# EasyEDA Pro project 11111.eprj

# Schematic Schematic1
Create Date: 2024-05-01; Page Name: P1; Project Name: 11111; Schematic Name: Schematic1; Update Date: 2024-05-01; Company: 嘉立创EDA; Page Size: A4; Version: V1.0
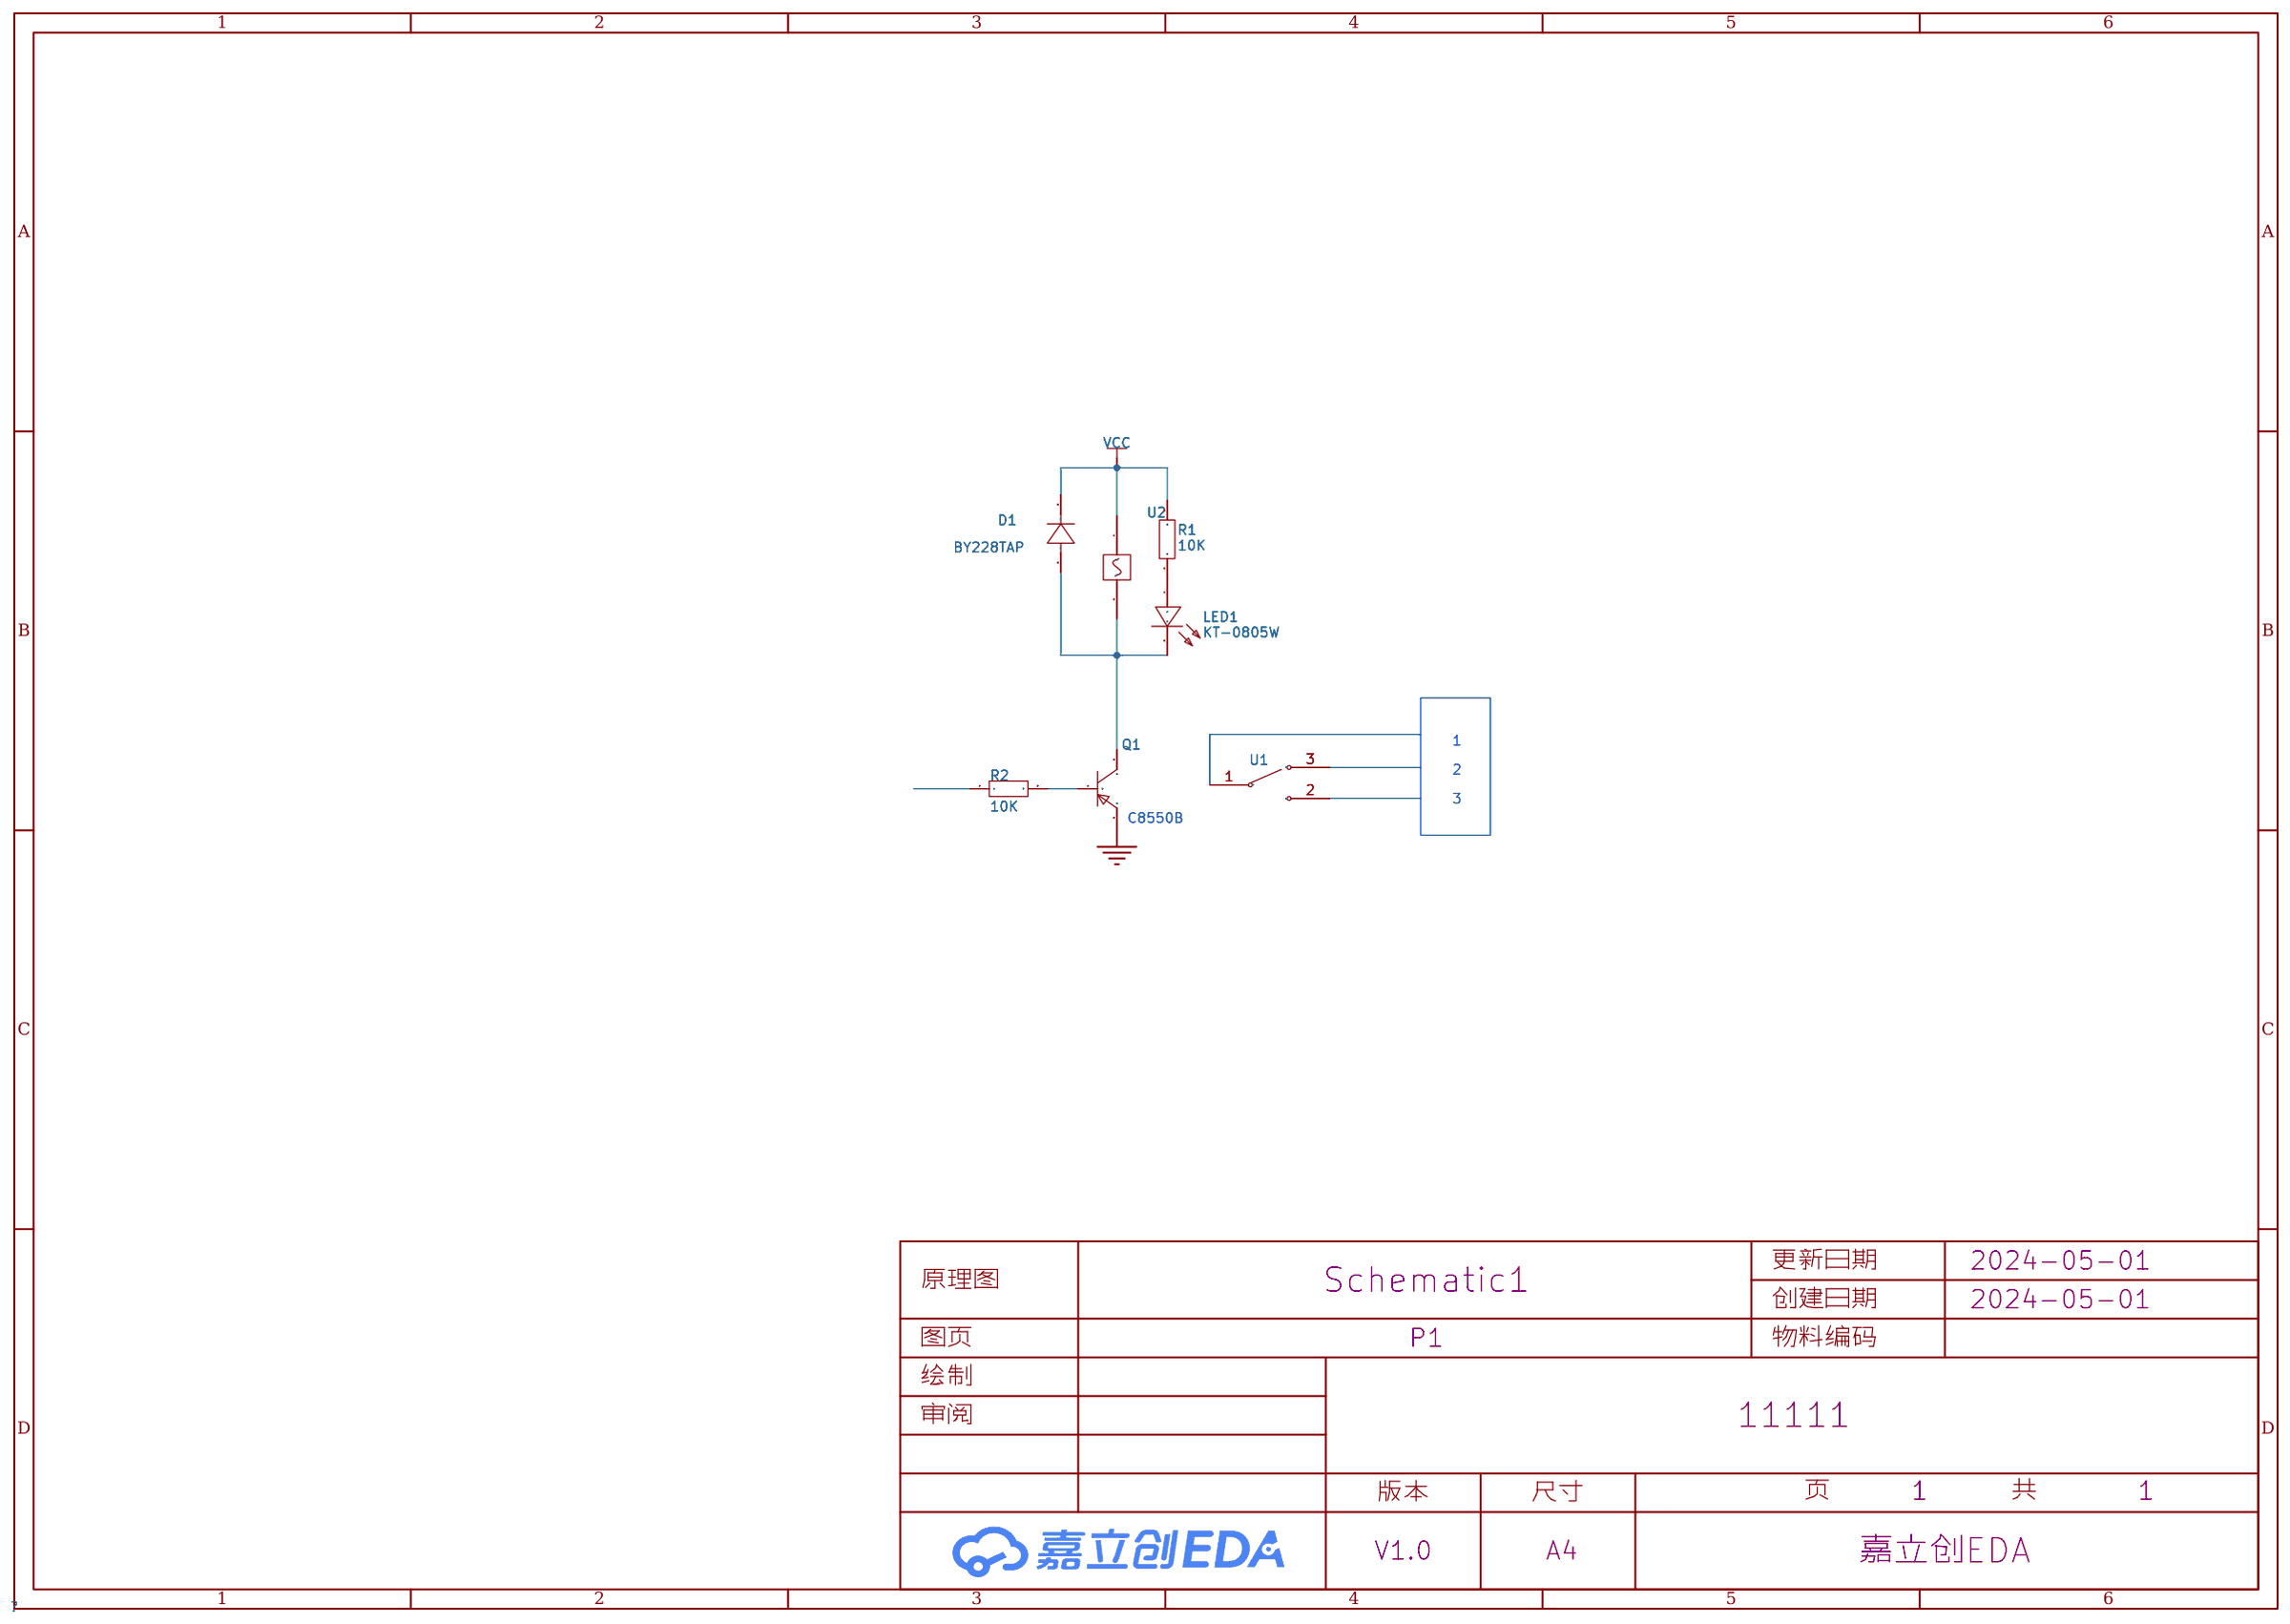
[diagram p0: schematic sheet]

## Parts
D1  BY228TAP  [SOD-64_L4.0-W4.3-P10.00-FD]
LED1  KT-0805W  [LED0805-R-RD]
Q1  -  [S8550P_SOT]
R1  10K  [R0603]
R2  10K  [R0603]
U1  -
U2  -

## Library data of the parts
D1 = BY228TAP: 二极管配置:-;正向压降(Vf):1.5V@5A;直流反向耐压(Vr):1.5kV;平均整流电流(Io):3A;; LCSC Part Name: 电压:1.5kV 电流:3A; Supplier Part: C962618; Manufacturer: VISHAY(威世); Supplier Footprint: SOD-64; JLCPCB Part Class: 扩展库; Datasheet: https://atta.szlcsc.com/upload/public/pdf/source/20201127/C962618_943537F8A4FB883EA807836BAFA124F1.pdf; Supplier: LCSC; Forward Voltage (Vf@If): 1.5V@5A; Reverse Voltage (Vr): 1.5kV; Average Rectified Current (Io): 3A; Reverse Leakage Current (Ir): 5uA@1500V; Reverse Recovery Time (trr): 20us
LED1 = KT-0805W: 色温6000K左右; LCSC Part Name: 0805 白灯 高亮; Supplier Part: C34499; Manufacturer: KENTO; Supplier Footprint: 0805; JLCPCB Part Class: 基础库; Datasheet: https://atta.szlcsc.com/upload/public/pdf/source/20221124/DAA20402FFC1FB071B8B6797757426FE.pdf; Supplier: LCSC
Q1 = S8550_SOT_PNP: Supplier Footprint: SOT-23
R1 R2 = Res_0603: Supplier Footprint: 0603
U1 = 单刀双置开关
U2 = 我也不知道叫什么

## Nets
GND: Q1.2(E)
VCC: D1.2(K) R1.2 U2.1
Net-(D1-1): D1.1(A) LED1.2(K) Q1.3(C) U2.2
Net-(LED1-1): LED1.1(A) R1.1
Net-(Q1-1): Q1.1(B) R2.2

Not connected (* = marked no-connect by the designer): R2 1; U1 1 2 3

## Notes on the sheet
- 1
- 2
- 3
- C8550B

# Schematic Schematic2
Create Date: 2024-05-02; Page Name: P1; Project Name: 11111; Schematic Name: Schematic2; Update Date: 2024-05-02; Company: 嘉立创EDA; Page Size: A4; Version: V1.0
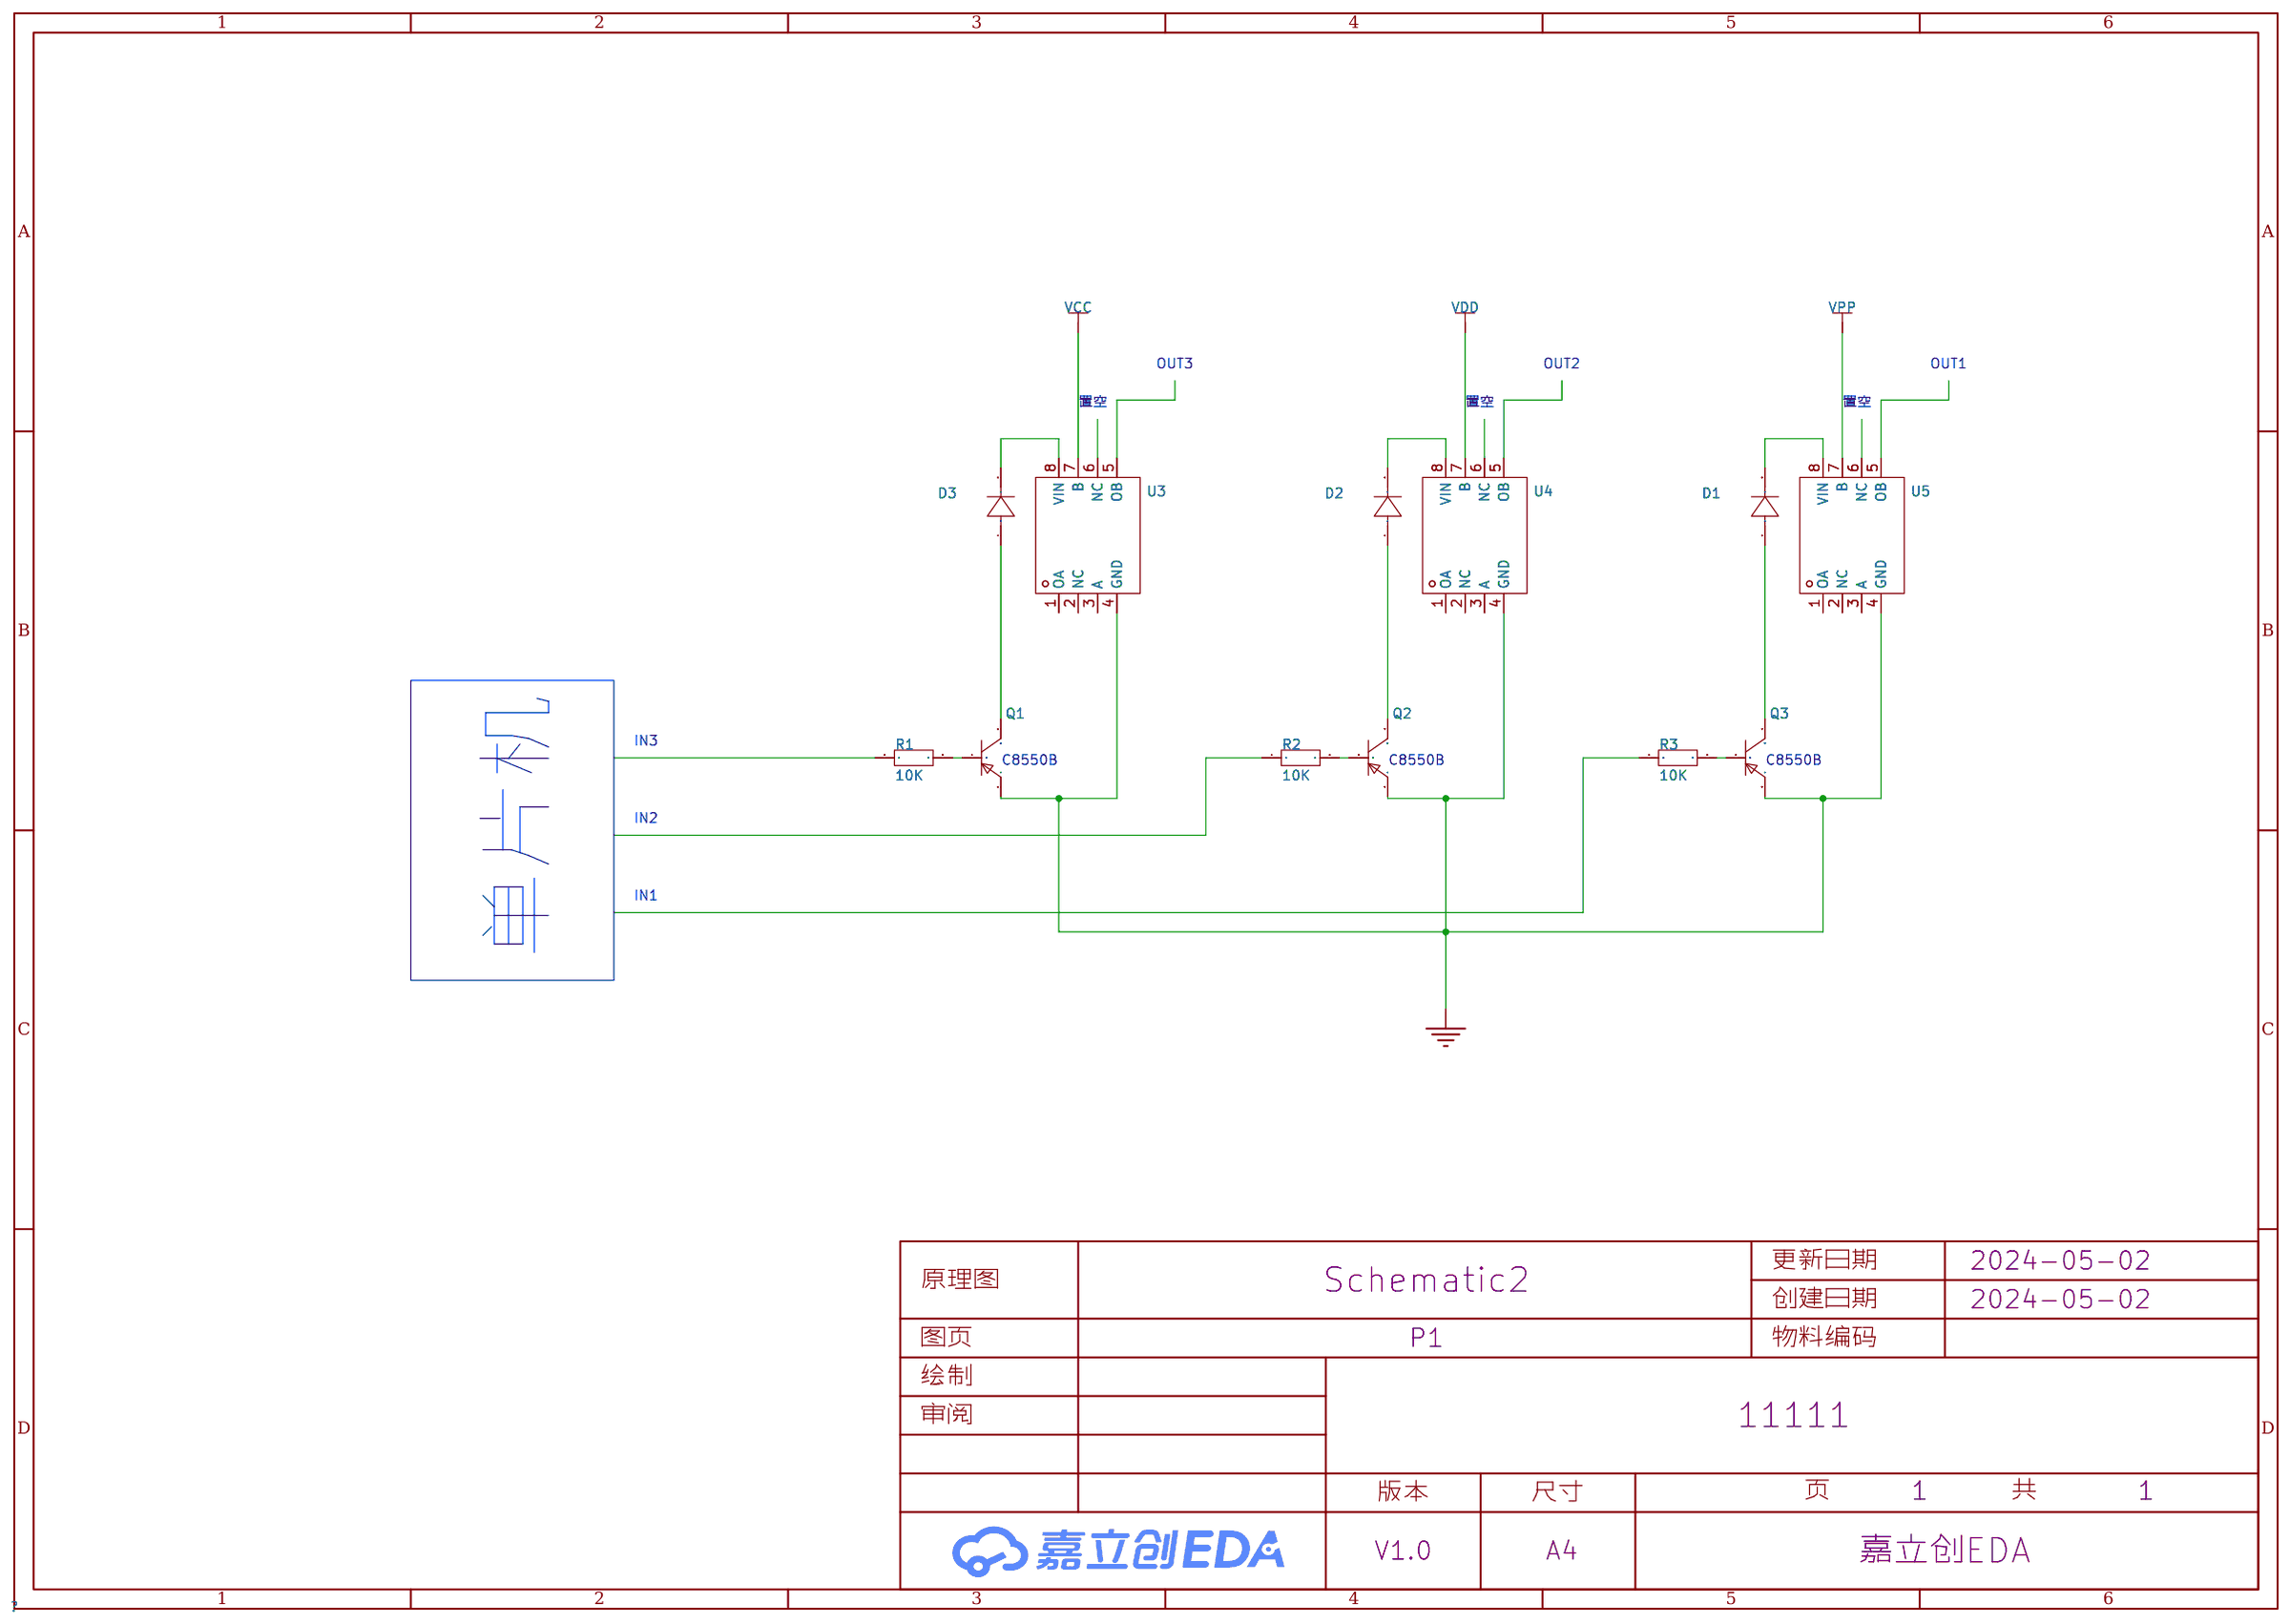
[diagram p1: schematic sheet]

## Parts
D1  BY228TAP  [SOD-64_L4.0-W4.3-P10.00-FD]
D2  BY228TAP  [SOD-64_L4.0-W4.3-P10.00-FD]
D3  BY228TAP  [SOD-64_L4.0-W4.3-P10.00-FD]
Q1  -  [S8550P_SOT]
Q2  -  [S8550P_SOT]
Q3  -  [S8550P_SOT]
R1  10K  [R0603]
R2  10K  [R0603]
R3  10K  [R0603]
U3  BL8023C  [SOP-8_L4.9-W3.9-P1.27-LS6.0-BL]
U4  BL8023C  [SOP-8_L4.9-W3.9-P1.27-LS6.0-BL]
U5  BL8023C  [SOP-8_L4.9-W3.9-P1.27-LS6.0-BL]

## Library data of the parts
D1-D3 = BY228TAP: 二极管配置:-;正向压降(Vf):1.5V@5A;直流反向耐压(Vr):1.5kV;平均整流电流(Io):3A;; LCSC Part Name: 电压:1.5kV 电流:3A; Supplier Part: C962618; Manufacturer: VISHAY(威世); Supplier Footprint: SOD-64; JLCPCB Part Class: 扩展库; Datasheet: https://atta.szlcsc.com/upload/public/pdf/source/20201127/C962618_943537F8A4FB883EA807836BAFA124F1.pdf; Supplier: LCSC; Forward Voltage (Vf@If): 1.5V@5A; Reverse Voltage (Vr): 1.5kV; Average Rectified Current (Io): 3A; Reverse Leakage Current (Ir): 5uA@1500V; Reverse Recovery Time (trr): 20us
Q1-Q3 = S8550_SOT_PNP: Supplier Footprint: SOT-23
R1-R3 = Res_0603: Supplier Footprint: 0603
U3-U5 = BL8023C: 磁保持继电器专用驱动芯片; LCSC Part Name: 继电器驱动芯片; Supplier Part: C140619; Manufacturer: BL(上海贝岭); Supplier Footprint: SOP-8; JLCPCB Part Class: 扩展库; Datasheet: https://atta.szlcsc.com/upload/public/pdf/source/20171113/C140619_15105612940191115772.pdf; Supplier: LCSC

## Nets
GND: Q1.2(E) Q2.2(E) Q3.2(E) U3.4(GND) U4.4(GND) U5.4(GND)
VCC: U3.7(B)
VDD: U4.7(B)
VPP: U5.7(B)
Net-(D1-1): D1.1(A) Q3.3(C)
Net-(D1-2): D1.2(K) U5.8(VIN)
Net-(D2-1): D2.1(A) Q2.3(C)
Net-(D2-2): D2.2(K) U4.8(VIN)
Net-(D3-1): D3.1(A) Q1.3(C)
Net-(D3-2): D3.2(K) U3.8(VIN)
Net-(Q1-1): Q1.1(B) R1.2
Net-(Q2-1): Q2.1(B) R2.2
Net-(Q3-1): Q3.1(B) R3.2

Not connected (* = marked no-connect by the designer): R1 1; R2 1; R3 1; U3 1(OA) 2(NC) 3(A) 5(OB) 6(NC); U4 1(OA) 2(NC) 3(A) 5(OB) 6(NC); U5 1(OA) 2(NC) 3(A) 5(OB) 6(NC)

## Notes on the sheet
- OUT3
- OUT2
- OUT1
- 置空
- 置空
- 置空
- IN3
- C8550B
- C8550B
- C8550B
- IN2
- IN1
- 单片机
